# EAGLE design Homework2 (EAGLE 7.5.0)

## Sheet 1 of 2
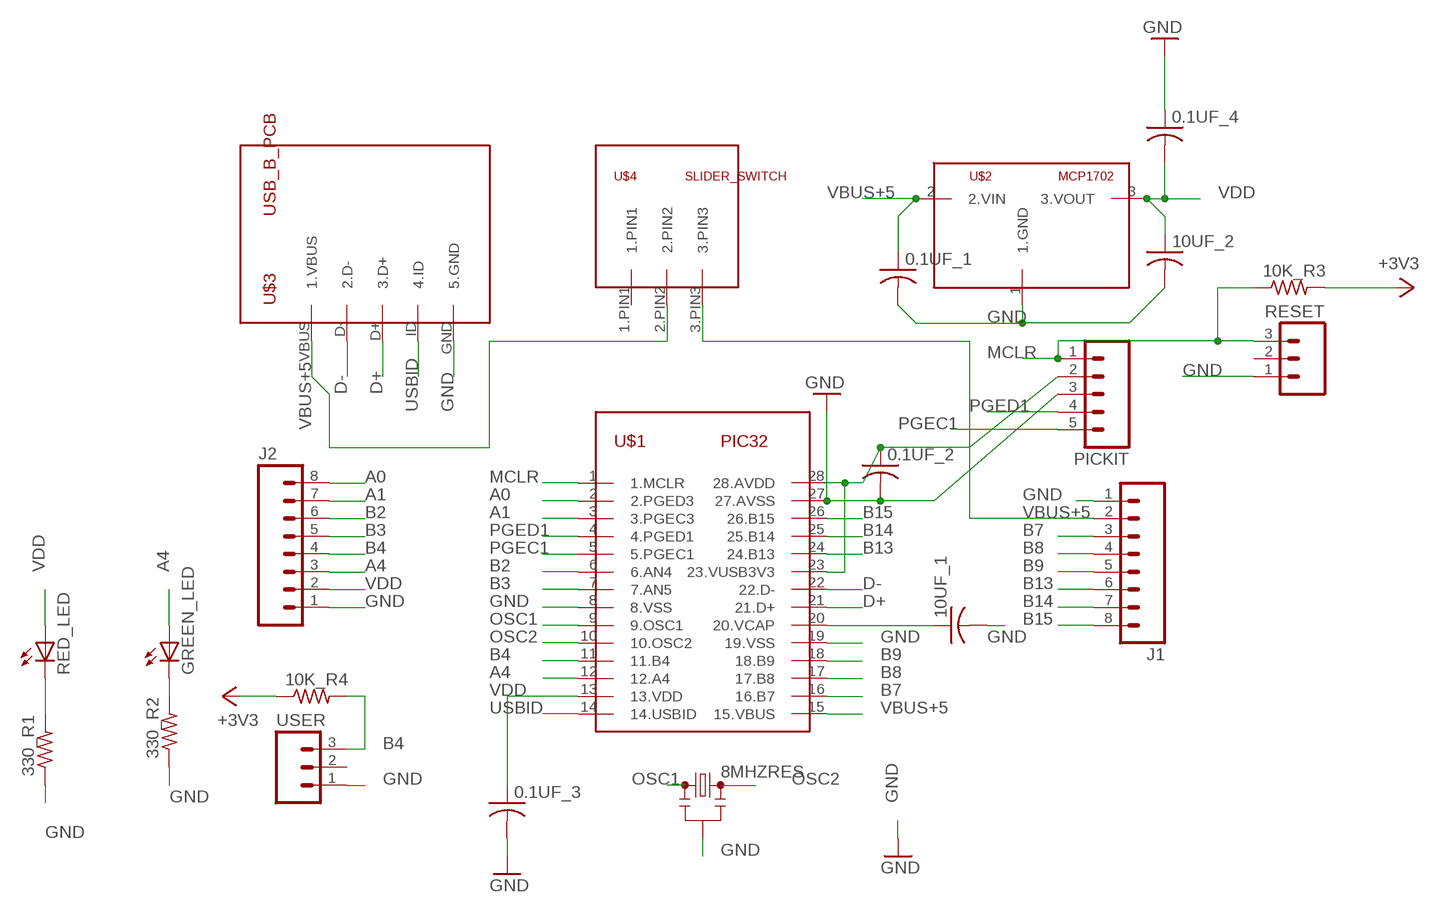
[diagram p0: schematic, sheet 1]

### Parts
0.1UF_1  C-US025-024X044  [C025-024X044]
0.1UF_2  C-US025-024X044  [C025-024X044]
0.1UF_3  C-US025-024X044  [C025-024X044]
0.1UF_4  C-US025-024X044  [C025-024X044]
8MHZRES  RESONATORPTH  [RESONATOR-PTH]
10K_R3  R-US_0204/5  [0204/5]
10K_R4  R-US_0204/5  [0204/5]
10UF_1  C-US050-024X044  [C050-024X044]
10UF_2  C-US050-024X044  [C050-024X044]
330_R1  R-US_0204/5  [0204/5]
330_R2  R-US_0204/5  [0204/5]
GREEN_LED  LED3MM  [LED3MM]
J1  M08SILK_FEMALE_PTH  [1X08]
J2  M08SILK_FEMALE_PTH  [1X08]
PICKIT  M05PTH  [1X05]
RED_LED  LED3MM  [LED3MM]
RESET  M03PTH  [1X03]
U$1  PIC32  [DIL28-3]
U$2  MCP1702  [TO92]
U$3  USB_B_PCB  [USB-MB-H]
U$4  SLIDER_SWITCH  [SLIDER_FOOTPRINT]
USER  M03PTH  [1X03]

### Nets
+3V3: 10K_R3.2 10K_R4.1
A0: J2.8 U$1.2(2.PGED3)
A1: J2.7 U$1.3(3.PGEC3)
A4: GREEN_LED.A J2.3 U$1.12(12.A4)
B2: J2.6 U$1.6(6.AN4)
B3: J2.5 U$1.7(7.AN5)
B4: 10K_R4.2 J2.4 U$1.11(11.B4) USER.3
B7: J1.3 U$1.16(16.B7)
B8: J1.4 U$1.17(17.B8)
B9: J1.5 U$1.18(18.B9)
B13: J1.6 U$1.24(24.B13)
B14: J1.7 U$1.25(25.B14)
B15: J1.8 U$1.26(26.B15)
D+: U$1.21(21.D+) U$3.D+(3.D+)
D-: U$1.22(22.D-) U$3.D-(2.D-)
GND: 0.1UF_1.2 0.1UF_2.2 0.1UF_3.2 0.1UF_4.1 8MHZRES.2 10UF_1.2 10UF_2.2 330_R1.1 330_R2.1 J1.1 J2.1 PICKIT.3 RESET.1 U$1.8(8.VSS) U$1.19(19.VSS) U$1.27(27.AVSS) U$2.1(1.GND) U$3.GND(5.GND) USER.1
MCLR: 10K_R3.1 PICKIT.1 RESET.3 U$1.1(1.MCLR)
N$1: 330_R2.2 GREEN_LED.K(C)
N$2: 330_R1.2 RED_LED.K(C)
N$9: 0.1UF_2.1 PICKIT.2 U$1.23(23.VUSB3V3) U$1.28(28.AVDD)
N$10: 10UF_1.1 U$1.20(20.VCAP)
OSC1: 8MHZRES.1 U$1.9(9.OSC1)
OSC2: 8MHZRES.3 U$1.10(10.OSC2)
PGEC1: PICKIT.5 U$1.5(5.PGEC1)
PGED1: PICKIT.4 U$1.4(4.PGED1)
USBID: U$1.14(14.USBID) U$3.ID(4.ID)
VBUS+5: 0.1UF_1.1 J1.2 U$1.15(15.VBUS) U$2.2(2.VIN) U$3.VBUS(1.VBUS) U$4.2.PIN2 U$4.3.PIN3
VDD: 0.1UF_3.1 0.1UF_4.2 10UF_2.1 J2.2 RED_LED.A U$1.13(13.VDD) U$2.3(3.VOUT)
Unconnected: RESET.2 U$4.1.PIN1 USER.2

## Sheet 2 of 2

## Library data of the parts
0.1UF_1-0.1UF_4 10UF_1 10UF_2 = Homework2:C-US: CAPACITOR, American symbol
8MHZRES = SparkFun-FreqCtrl:RESONATOR: Resonator Small SMD resonator. Used, eg, on the Arduino Pro/ Pro Mini boards. 8MHz- XTAL-08895 16MHz- XTAL-08900
10K_R3 10K_R4 330_R1 330_R2 = Homework2:R-US_: RESISTOR, American symbol
GREEN_LED RED_LED = Homework2:LED: LED OSRAM: - CHIPLED LG R971, LG N971, LY N971, LG Q971, LY Q971, LO R971, LY R971 LH N974, LH R974 LS Q976, LO Q976, LY Q976 LO Q996 - Hyper CHIPLED LW Q18S LB Q993, LB Q99A, LB R99A - SideLED LS A670, LO A670, LY A670, LG A670, LP A670 LB A673, LV A673, LT A673, LW A673 LH A674 LY A675 LS A676, LA A676, LO A676, LY A676, LW A676 LS A679, LY A679, LG A679 - Hyper Micro SIDELED® LS Y876, LA Y876, LO Y876, LY Y876 LT Y87S - SmartLED LW L88C, LW L88S LB L89C, LB L89S, LG L890 LS L89K, LO L89K, LY L89K LS L896, LA L896, LO L896, LY L896 - TOPLED LS T670, LO T670, LY T670, LG T670, LP T670 LSG T670, LSP T670, LSY T670, LOP T670, LYG T670 LG T671, LOG T671, LSG T671 LB T673, LV T673, LT T673, LW T673 LH T674 LS T676, LA T676, LO T676, LY T676, LB T676, LH T676, LSB T676, LW T676 LB T67C, LV T67C, LT T67C, LS T67K, LO T67K, LY T67K, LW E67C LS E67B, LA E67B, LO E67B, LY E67B, LB E67C, LV E67C, LT E67C LW T67C LS T679, LY T679, LG T679 LS T770, LO T770, LY T770, LG T770, LP T770 LB T773, LV T773, LT T773, LW T773 LH T774 LS E675, LA E675, LY E675, LS T675 LS T776, LA T776, LO T776, LY T776, LB T776 LHGB T686 LT T68C, LB T68C - Hyper Mini TOPLED® LB M676 - Mini TOPLED Santana® LG M470 LS M47K, LO M47K, LY M47K Source: http://www.osram.convergy.de LUXEON: - LUMILED® LXK2-PW12-R00, LXK2-PW12-S00, LXK2-PW14-U00, LXK2-PW14-V00 LXK2-PM12-R00, LXK2-PM12-S00, LXK2-PM14-U00 LXK2-PE12-Q00, LXK2-PE12-R00, LXK2-PE12-S00, LXK2-PE14-T00, LXK2-PE14-U00 LXK2-PB12-K00, LXK2-PB12-L00, LXK2-PB12-M00, LXK2-PB14-N00, LXK2-PB14-P00, LXK2-PB14-Q00 LXK2-PR12-L00, LXK2-PR12-M00, LXK2-PR14-Q00, LXK2-PR14-R00 LXK2-PD12-Q00, LXK2-PD12-R00, LXK2-PD12-S00 LXK2-PH12-R00, LXK2-PH12-S00 LXK2-PL12-P00, LXK2-PL12-Q00, LXK2-PL12-R00 Source: www.luxeon.com KINGBRIGHT: KA-3528ASYC Source: www.kingbright.com
J1 J2 = Homework2:M08: Header 8 Standard 8-pin 0.1" header. Use with straight break away headers (SKU : PRT-00116), right angle break away headers (PRT-00553), swiss pins (PRT-00743), machine pins (PRT-00117), and female headers (PRT-00115).; PROD_ID: CONN-08438
PICKIT = Homework2:M05: Header 5 Standard 5-pin 0.1" header. Use with straight break away headers (SKU : PRT-00116), right angle break away headers (PRT-00553), swiss pins (PRT-00743), machine pins (PRT-00117), and female headers (PRT-00115). Molex polarized connector foot print use with SKU : PRT-08230 with associated crimp pins and housings.
RESET USER = Homework2:M03: Header 3 Standard 3-pin 0.1" header. Use with straight break away headers (SKU : PRT-00116), right angle break away headers (PRT-00553), swiss pins (PRT-00743), machine pins (PRT-00117), and female headers (PRT-00115). Molex polarized connector foot print use with SKU : PRT-08232 with associated crimp pins and housings.
U$1 = Homework2:PIC32
U$2 = Homework2:MCP1702
U$3 = Homework2:USB_B_PCB
U$4 = Homework2:SLIDER_SWITCH

## Board
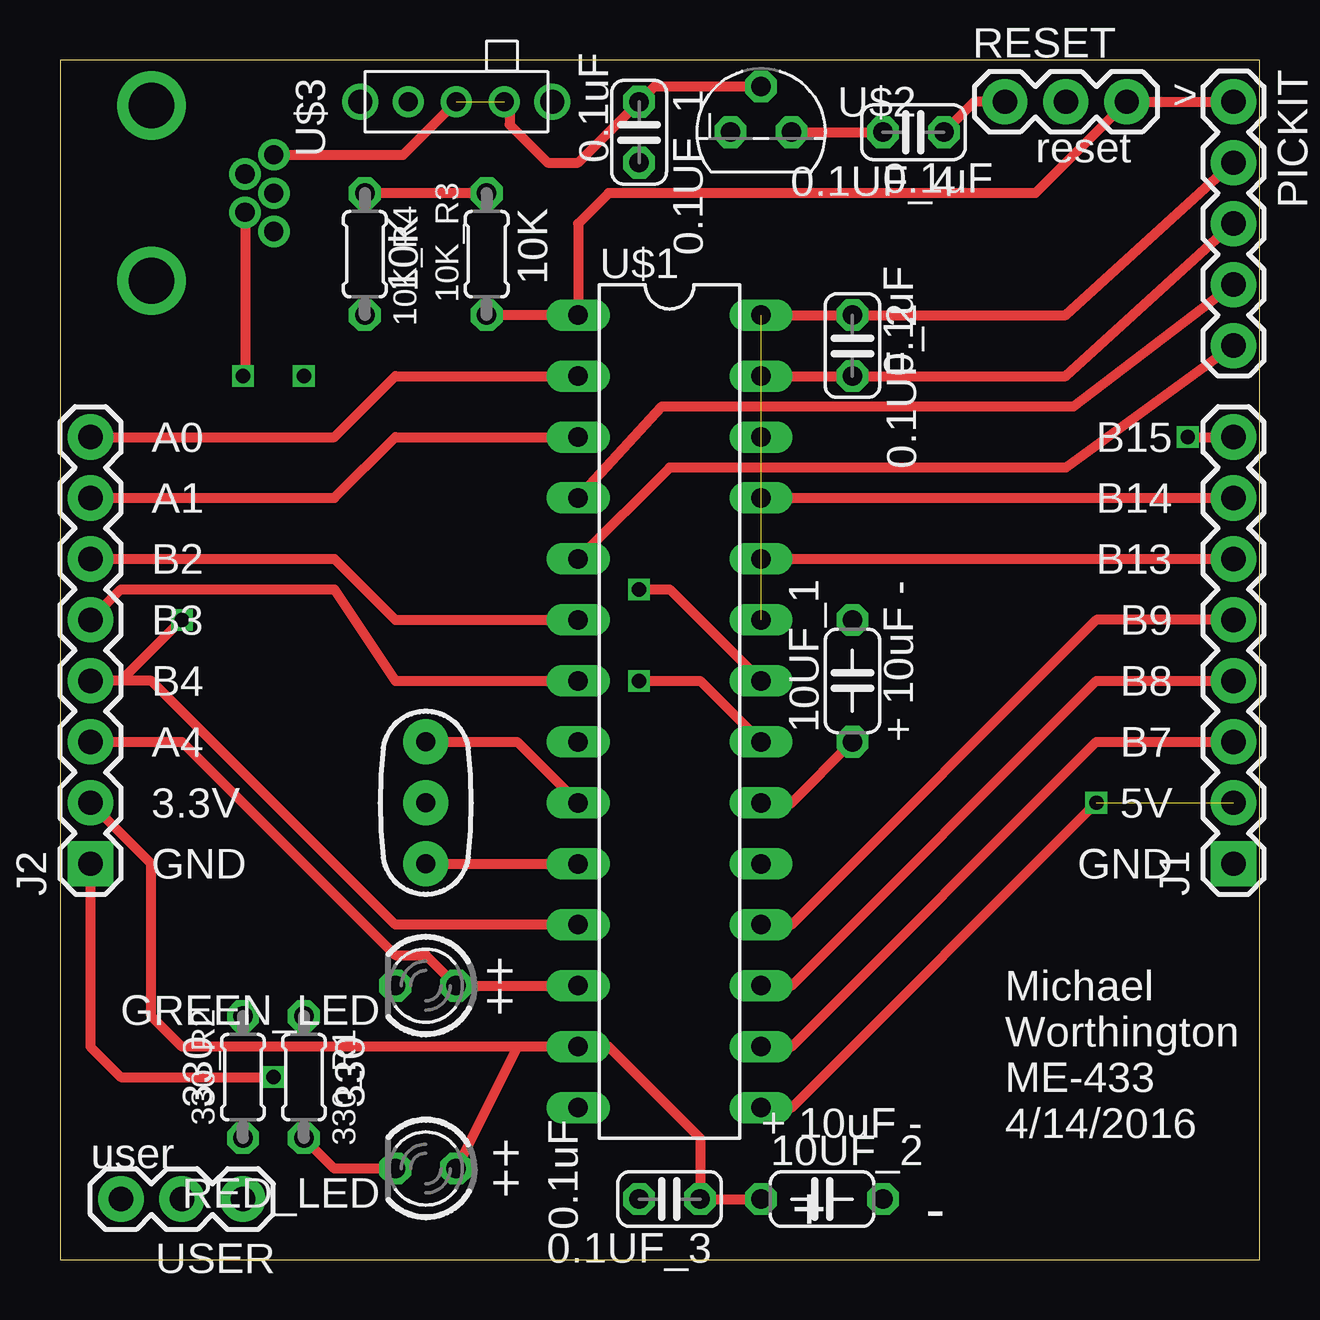
[diagram p1: board, top side]
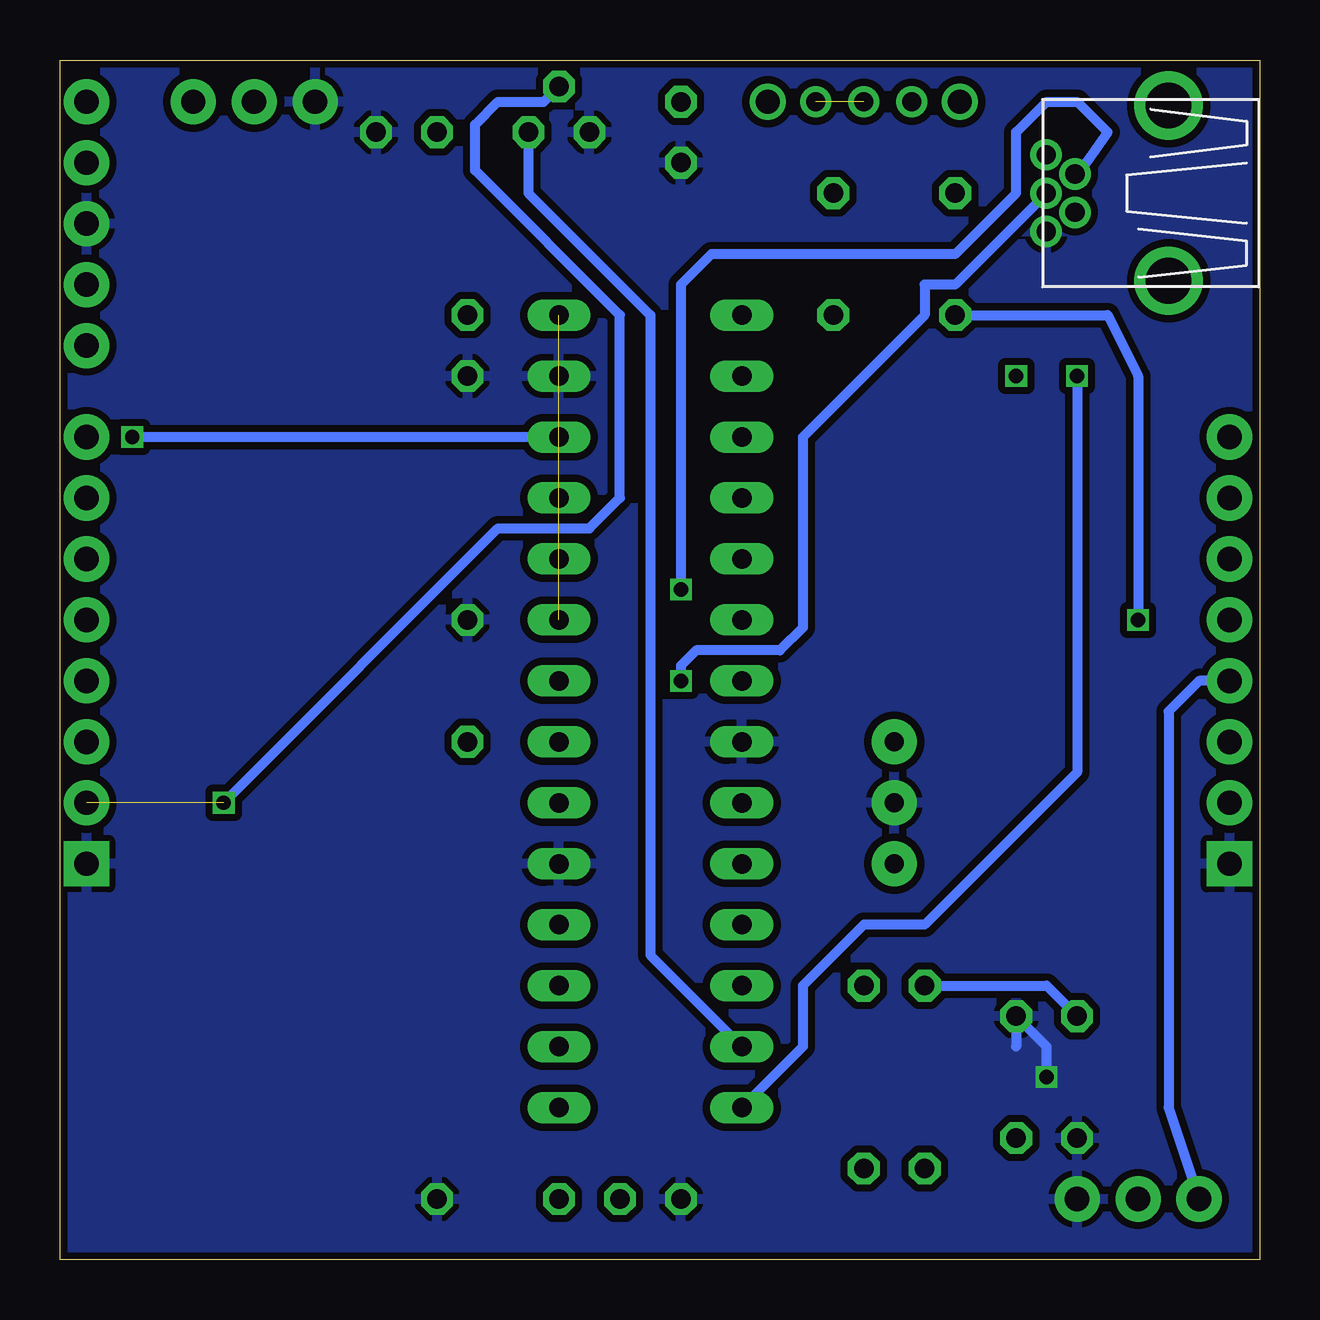
[diagram p2: board, bottom side, seen from below]

Size 50 x 50 mm. Coordinates in mm from the lower left corner, seen from the top.
Outline: 0,0 50,0 50,50 0,50 0,0
Copper layers (1*16): Top 0.035mm / dielectric 1.5mm / Bottom 0.035mm
Design rules "SeeedStudio_2layer_DRU_no_angle_20140221": minimum track width 6mil, minimum drill 12mil, track to track 6mil, track to pad 6mil, pad to pad 6mil, via to via 6mil, smd to smd 0mil, copper to edge 10mil, drill to drill 10mil, minimum pad ring 10mil, minimum via ring 6mil, stop-mask expansion 2mil, vias tented up to drill 100mil, thermal gap 10mil

### Footprints (pad centres in the part's own frame; a part is rotated, then mirrored left to right if it is on the bottom)
C025-024X044 = drill 0.813 octagon: 1 -1.27,0; 2 1.27,0
RESONATOR-PTH = drill 0.8 pad 1.88: 1 -2.54,0; 2 0,0; 3 2.54,0
0204/5 = drill 0.813 octagon: 1 -2.54,0; 2 2.54,0
C050-024X044 = drill 0.813 octagon: 1 -2.54,0; 2 2.54,0
LED3MM = drill 0.813 octagon: A -1.27,0; K 1.27,0
1X08 = drill 1.016 pad 1.88 square: 1 0,0 | drill 1.016 pad 1.88: 2 2.54,0; 3 5.08,0; 4 7.62,0; 5 10.16,0; 6 12.7,0; 7 15.24,0; 8 17.78,0
1X05 = drill 1.016 pad 1.88: 1 0,0; 2 2.54,0; 3 5.08,0; 4 7.62,0; 5 10.16,0
1X03 = drill 1.016 pad 1.88: 1 0,0; 2 2.54,0; 3 5.08,0
DIL28-3 = drill 0.813 long: 1 -16.51,-3.81; 2 -13.97,-3.81; 3 -11.43,-3.81; 4 -8.89,-3.81; 5 -6.35,-3.81; 6 -3.81,-3.81; 7 -1.27,-3.81; 8 1.27,-3.81; 9 3.81,-3.81; 10 6.35,-3.81; 11 8.89,-3.81; 12 11.43,-3.81; 13 13.97,-3.81; 14 16.51,-3.81; 15 16.51,3.81; 16 13.97,3.81; 17 11.43,3.81; 18 8.89,3.81; 19 6.35,3.81; 20 3.81,3.81; 21 1.27,3.81; 22 -1.27,3.81; 23 -3.81,3.81; 24 -6.35,3.81; 25 -8.89,3.81; 26 -11.43,3.81; 27 -13.97,3.81; 28 -16.51,3.81
TO92 = drill 0.813 octagon: 1 -1.27,0; 2 0,1.905; 3 1.27,0
USB-MB-H = drill 0.8: D+ 5.1,0; D- 3.9,0.8; GND 5.1,-1.6; ID 3.9,-0.8; VBUS 5.1,1.6 | drill 1.9: P$6 0,-3.65; P$7 0,3.65
SLIDER_FOOTPRINT = drill 0.8: 1.PIN1 -2,0; 2.PIN2 0,0; 3.PIN3 2,0 | drill 1: P$3 -4,0; P$5 4,0

### Placement (x,y rotation side)
0.1UF_1  24.13,46.99 270 top
0.1UF_2  33.02,38.1 270 top
0.1UF_3  25.4,2.54 180 top
0.1UF_4  35.56,46.99 180 top
8MHZRES  15.24,19.05 270 top
10K_R3  17.78,41.91 90 top
10K_R4  12.7,41.91 270 top
10UF_1  33.02,24.13 90 top
10UF_2  31.75,2.54 0 top
330_R1  10.16,7.62 270 top
330_R2  7.62,7.62 90 top
GREEN_LED  15.24,11.43 180 top
J1  48.9,16.51 90 top
J2  1.27,16.51 90 top
PICKIT  48.9,48.26 270 top
RED_LED  15.24,3.81 180 top
RESET  39.37,48.26 0 top
U$1  25.4,22.86 270 top
U$2  29.21,46.99 0 top
U$3  3.81,44.45 0 top
U$4  16.51,48.26 0 top
USER  7.62,2.54 180 top

### Tracks (layer width: path | path; a pad name or v marks a point on that pad's centre or on a via)
+3V3
  Top 0.406: 10K_R3.2 10K_R4.1
A0
  Top 0.406: J2.8 11.43,34.29 13.97,36.83 U$1.2
A1
  Top 0.406: J2.7 11.43,31.75 13.97,34.29 U$1.3
A4
  Top 0.406: U$1.12 GREEN_LED.A 15.24,12.7 13.97,12.7 5.08,21.59 J2.3
B2
  Top 0.406: J2.6 11.43,29.21 13.97,26.67 U$1.6
B3
  Top 0.406: U$1.7 13.97,24.13 11.43,27.94 2.54,27.94 J2.5
B4  (via drill 0.6)
  Top 0.406: U$1.11 13.97,13.97 3.81,24.13 2.54,24.13 | 2.54,24.13 J2.4 | v5.08,26.67 2.54,24.13
  Bottom 0.406: J2.4 2.54,24.13 3.81,22.86 3.81,6.35 USER.3 | 10K_R4.2 6.35,39.37 5.08,36.83 v5.08,26.67
B7
  Top 0.406: U$1.16 30.48,8.89 43.18,21.59 J1.3
B8
  Top 0.406: U$1.17 30.48,11.43 43.18,24.13 J1.4
B9
  Top 0.406: J1.5 43.18,26.67 30.48,13.97 U$1.18
B13
  Top 0.406: U$1.24 J1.6
B14
  Top 0.406: U$1.25 J1.7
B15  (via drill 0.6)
  Top 0.406: v46.99,34.29 J1.8
  Bottom 0.406: U$1.26 v46.99,34.29
D+  (via drill 0.6)
  Top 0.406: v24.13,24.13 26.67,24.13 U$1.21
  Bottom 0.406: U$3.D+ 8.91,44.43 12.7,40.64 13.97,40.64 13.97,39.37 19.05,34.29 19.05,26.35 20,25.4 23.5,25.4 24.13,24.77 v24.13,24.13
D-  (via drill 0.6)
  Top 0.406: v24.13,27.94 25.4,27.94 U$1.22
  Bottom 0.406: v24.13,27.94 24.13,40.64 22.86,41.91 12.7,41.91 10.16,44.45 10.16,46.99 8.89,48.26 7.62,48.26 6.35,46.99 7.24,45.72 U$3.D-
GND  (via drill 0.6)
  Top 0.406: RESET.1 38.1,48.26 0.1UF_4.1 | J2.1 1.27,8.89 2.54,7.62 v8.89,7.62 | PICKIT.3 41.91,36.83 0.1UF_2.2 U$1.27
  Bottom 0.406: 10.16,8.89 330_R1.1 8.89,8.89 v8.89,7.62
  pour Bottom (isolate 0.305): 0,0 50.8,0 50.8,50.8 0,50.8 0,49.53
MCLR
  Top 0.406: PICKIT.1 RESET.3 40.64,44.45 22.86,44.45 21.59,43.18 U$1.1 10K_R3.1
N$1
  Bottom 0.406: GREEN_LED.K 8.89,11.43 330_R2.2
N$2
  Top 0.406: RED_LED.K 11.43,3.81 330_R1.2
N$3  (via drill 0.6)
  other vias: 10.16,36.83
N$9  (1 unrouted)
  Top 0.406: PICKIT.2 41.91,39.37 0.1UF_2.1 U$1.28
N$10
  Top 0.406: U$1.20 30.48,19.05 10UF_1.1
OSC1
  Top 0.406: 8MHZRES.1 19.05,21.59 U$1.9
OSC2
  Top 0.406: 8MHZRES.3 U$1.10
PGEC1
  Top 0.406: PICKIT.5 41.91,33.02 25.4,33.02 U$1.5
PGED1
  Top 0.406: PICKIT.4 42.23,35.56 25.08,35.56 U$1.4
USBID  (via drill 0.6)
  Top 0.406: U$3.ID 7.71,36.92 v7.62,36.83
  Bottom 0.406: v7.62,36.83 7.62,20.32 13.97,13.97 16.51,13.97 19.05,11.43 19.05,8.89 U$1.14
VBUS+5  (via drill 0.6)  (2 unrouted)
  Top 0.406: U$1.15 30.48,6.35 v43.18,19.05 | U$2.2 24.77,48.9 0.1UF_1.1 21.59,45.72 20.32,45.72 18.73,47.31 18.73,48.04 U$4.3.PIN3 | U$3.VBUS 14.3,46.05 U$4.2.PIN2
  Bottom 0.406: v43.18,19.05 31.75,30.48 27.94,30.48 26.67,31.75 26.67,39.37 32.7,45.4 32.7,47.31 31.75,48.26 29.84,48.26 U$2.2
VDD
  Top 0.406: U$2.3 0.1UF_4.2 | 19.05,8.89 U$1.13 22.86,8.89 26.67,5.08 0.1UF_3.1 10UF_2.1 | 19.05,8.89 RED_LED.A | 19.05,8.89 5.08,8.89 3.81,10.16 3.81,16.51 J2.2
  Bottom 0.406: U$2.3 30.48,44.45 25.4,39.37 25.4,12.7 U$1.13

### Text on the board
tPlace: > | 0.1uF | reset | 0.1uF | 10K | 10K | 0.1uF | A0 | B15 | A1 | B14 | B2 | B13 | B3 | B9 | B4 | B8 | + 10uF - | A4 | B7 | 3.3V | 5V | GND | GND | ++ | 330 | 330 | ++ | + 10uF - | Michael / Worthington / ME-433 / 4/14/2016 | user | 0.1uF | + -